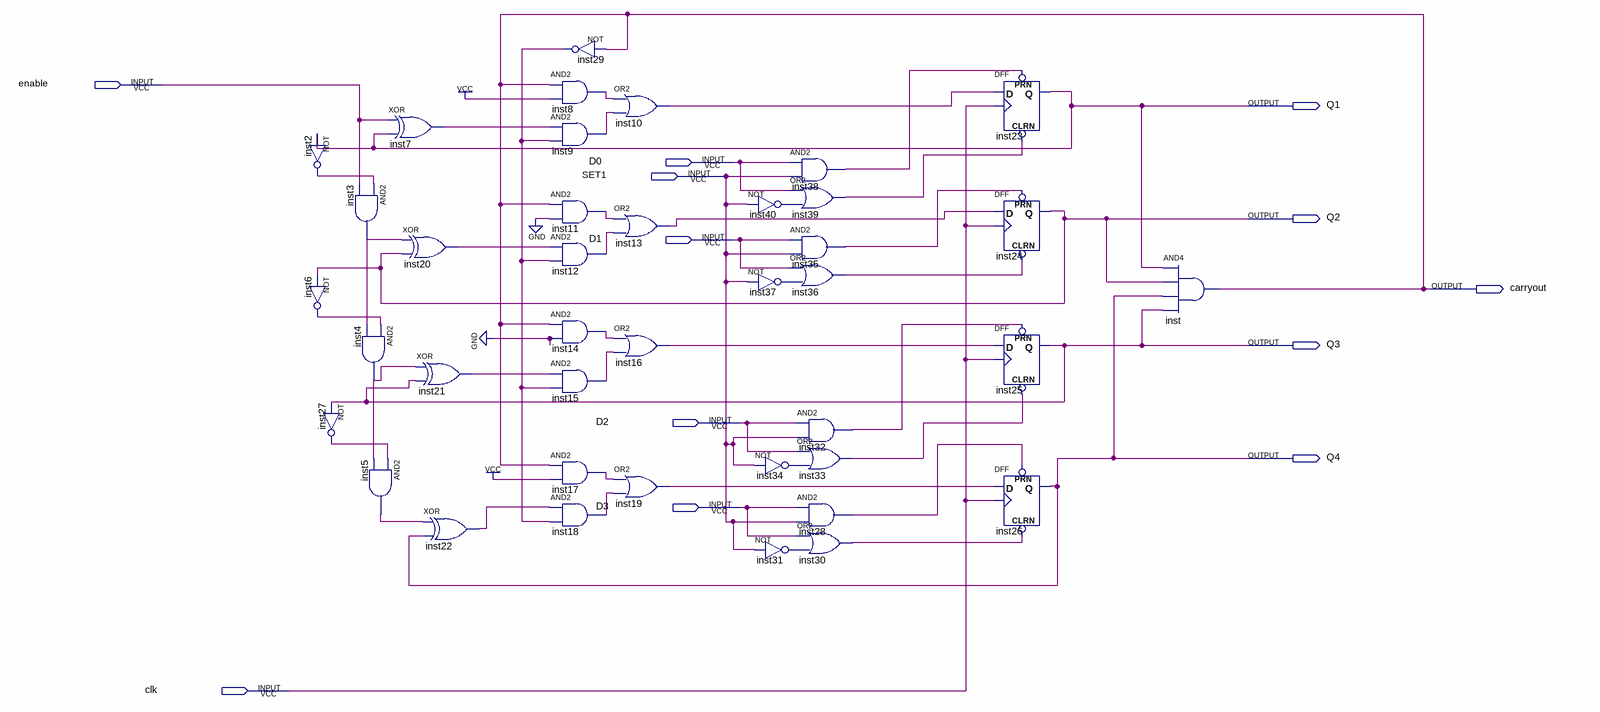
[diagram p0: schematic sheet]
// Quartus schematic clkBCD.bdf as structural Verilog: 40 symbols, 12 pins
module clkBCD (
  input  enable,
  input  D0,
  input  SET1,
  input  D1,
  input  D2,
  input  D3,
  input  clk,
  output Q1,
  output Q2,
  output carryout,
  output Q3,
  output Q4
);

  wire inst2_out, inst3_out, inst4_out, inst5_out, inst6_out, inst7_out, inst8_out, inst9_out, inst10_out,
       inst11_out, inst12_out, inst13_out, inst14_out, inst15_out, inst16_out, inst17_out, inst18_out,
       inst19_out, inst20_out, inst21_out, inst22_out, inst27_out, inst28_out, inst29_out, inst30_out,
       inst31_out, inst32_out, inst33_out, inst34_out, inst35_out, inst36_out, inst37_out, inst38_out,
       inst39_out, inst40_out;

  not inst2 (inst2_out, Q1);
  not inst6 (inst6_out, Q2);
  not inst27 (inst27_out, Q3);
  and inst3 (inst3_out, inst2_out, enable);
  and inst4 (inst4_out, inst6_out, inst3_out);
  and inst5 (inst5_out, inst27_out, inst4_out);
  xor inst7 (inst7_out, enable, Q1);
  xor inst20 (inst20_out, inst3_out, Q2);
  xor inst21 (inst21_out, inst4_out, Q3);
  xor inst22 (inst22_out, inst5_out, Q4);
  not inst29 (inst29_out, carryout);
  and inst8 (inst8_out, carryout, 1'b1);
  and inst9 (inst9_out, inst7_out, inst29_out);
  and inst11 (inst11_out, carryout, 1'b0);
  and inst12 (inst12_out, inst20_out, inst29_out);
  and inst14 (inst14_out, carryout, 1'b0);
  and inst15 (inst15_out, inst21_out, inst29_out);
  and inst17 (inst17_out, carryout, 1'b1);
  and inst18 (inst18_out, inst22_out, inst29_out);
  or inst10 (inst10_out, inst8_out, inst9_out);
  or inst13 (inst13_out, inst11_out, inst12_out);
  or inst16 (inst16_out, inst14_out, inst15_out);
  or inst19 (inst19_out, inst17_out, inst18_out);
  not inst40 (inst40_out, SET1);
  not inst37 (inst37_out, SET1);
  not inst34 (inst34_out, SET1);
  not inst31 (inst31_out, SET1);
  and inst38 (inst38_out, D0, SET1);
  or inst39 (inst39_out, D0, inst40_out);
  and inst35 (inst35_out, D1, SET1);
  or inst36 (inst36_out, D1, inst37_out);
  and inst32 (inst32_out, D2, SET1);
  or inst33 (inst33_out, D2, inst34_out);
  and inst28 (inst28_out, D3, SET1);
  or inst30 (inst30_out, D3, inst31_out);
  DFF inst23 (.CLRN(inst39_out), .CLK(clk), .D(inst10_out), .PRN(inst38_out), .Q(Q1));
  DFF inst24 (.CLRN(inst36_out), .CLK(clk), .D(inst13_out), .PRN(inst35_out), .Q(Q2));
  DFF inst25 (.CLRN(inst33_out), .CLK(clk), .D(inst16_out), .PRN(inst32_out), .Q(Q3));
  DFF inst26 (.CLRN(inst30_out), .CLK(clk), .D(inst19_out), .PRN(inst28_out), .Q(Q4));
  and inst (carryout, Q1, Q2, Q4, Q3);
endmodule
